# Altium schematic sheet MSP432P401R_Mini_System.SchDoc
size A4
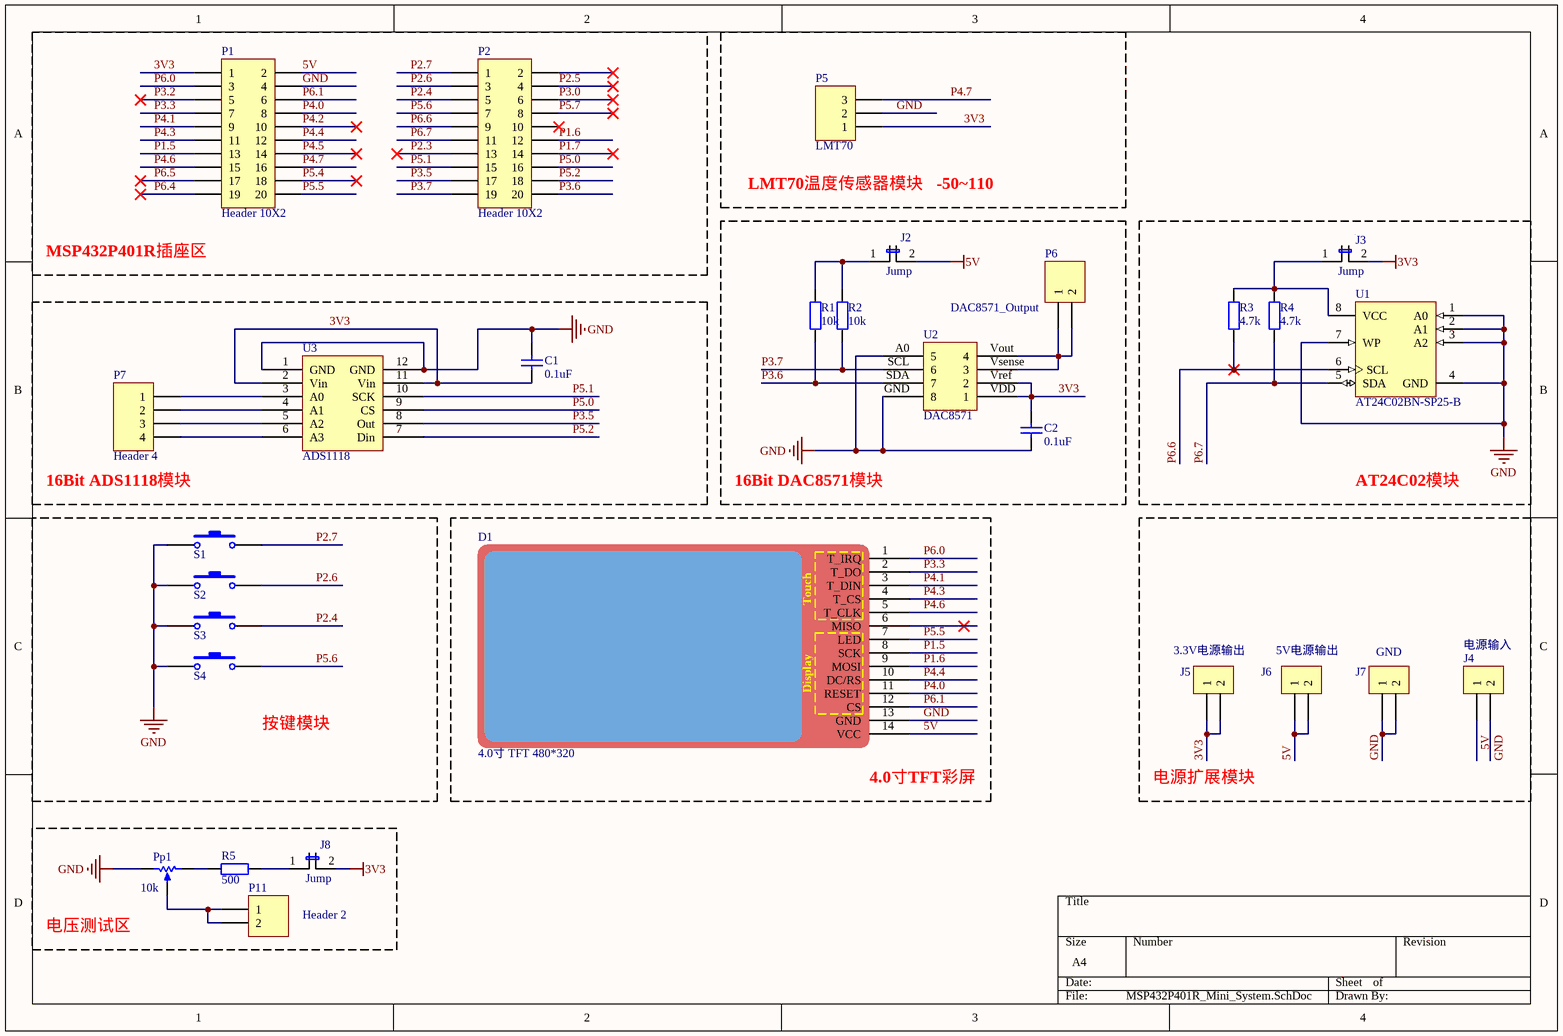
[diagram p0: MSP432P401R_Mini_System.SchDoc]

## Parts
C1  0.1uF  [0805_C]
C2  0.1uF  [0805_C]
D1  4.0寸 TFT 480*320  [4.0 TFT]
J2  Jump  [Jump]
J3  Jump  [Jump]
J4  电源输入  [XH2.54-2P]
J5  3.3V电源输出  [WJ500V-5.08-2]
J6  5V电源输出  [WJ500V-5.08-2]
J7  GND  [WJ500V-5.08-2]
J8  Jump  [jump]
P1  Header 10X2  [HDR2X10]
P2  Header 10X2  [HDR2X10]
P5  LMT70  [HDR-1X3_M]
P6  DAC8571_Output  [HDR-1X2_H]
P7  Header 4  [HDR1X4]
P11  Header 2  [HDR1X2]
Pp1  10k  [RM065]
R1  10k  [0805_R]
R2  10k  [0805_R]
R3  4.7k  [0805_R]
R4  4.7k  [0805_R]
R5  500  [0805_R]
S1  S1  [TSW SMD-3*6*4.3]
S2  S2  [TSW SMD-3*6*4.3]
S3  S3  [TSW SMD-3*6*4.3]
S4  S4  [TSW SMD-3*6*4.3]
U1  AT24C02BN-SP25-B  [DIP8-300_MH]
U2  DAC8571  [DIP8-300_MH]
U3  ADS1118  [ADS1118]

## Blocks framed on the sheet
MSP432P401R插座区: P1 P2
LMT70温度传感器模块   -50~110: P5
16Bit DAC8571模块: C2 J2 P6 R1 R2 U2
AT24C02模块: J3 R3 R4 U1
16Bit ADS1118模块: C1 P7 U3
按键模块: S1-S4
4.0寸TFT彩屏: D1
电源扩展模块: J4-J7
电压测试区: J8 P11 Pp1 R5

## Nets
3V3: C1.1 C2.2 J3.2 J5.1 J5.2 J8.2 P1.1 P5.1 U2.VDD(1) U2.Vref(2) U3.2(Vin) U3.11(Vin)
5V: D1.14(VCC) J2.2 J4.1 J6.1 J6.2 P1.2
GND: C1.2 C2.1 D1.13(GND) J4.2 J7.1 J7.2 P1.4 P5.2 Pp1.3(BOT) S1.1 S2.1 S3.1 S4.1 U1.1(A0) U1.2(A1) U1.3(A2) U1.4(GND) U1.7(WP) U2.A0(5) U2.GND(8) U3.1(GND) U3.12(GND)
P1.5: D1.8(SCK) P1.13
P1.6: D1.9(MOSI) P2.12
P1.7: P2.14
P2.3: P2.13
P2.4: P2.5 S3.2
P2.5: P2.4
P2.6: P2.3 S2.2
P2.7: P2.1 S1.2
P3.0: P2.6
P3.2: P1.5
P3.3: D1.2(T_DO) P1.7
P3.5: P2.17 U3.8(Out)
P3.6: P2.20 R1.1 U2.SDA(7)
P3.7: P2.19 R2.1 U2.SCL(6)
P4.0: D1.11(RESET) P1.8
P4.1: D1.3(T_DIN) P1.9
P4.2: P1.10
P4.3: D1.4(T_CS) P1.11
P4.4: D1.10(DC/RS) P1.12
P4.5: P1.14
P4.6: D1.5(T_CLK) P1.15
P4.7: P1.16 P5.3
P5.0: P2.16 U3.9(CS)
P5.1: P2.15 U3.10(SCK)
P5.2: P2.18 U3.7(Din)
P5.4: P1.18
P5.5: D1.7(LED) P1.20
P5.6: P2.7 S4.2
P5.7: P2.8
P6.0: D1.1(T_IRQ) P1.3
P6.1: D1.12(CS) P1.6
P6.4: P1.19
P6.5: P1.17
P6.6: P2.9 R3.1 U1.6(SCL)
P6.7: P2.11 R4.1 U1.5(SDA)
NetJ2_1: J2.1 R1.2 R2.2
NetJ3_1: J3.1 R3.2 R4.2 U1.8(VCC)
NetJ8_1: J8.1 R5.1
NetP6_1: P6.1 P6.2 U2.Vout(4) U2.Vsense(3)
NetP7_1: P7.1 U3.3(A0)
NetP7_2: P7.2 U3.4(A1)
NetP7_3: P7.3 U3.5(A2)
NetP7_4: P7.4 U3.6(A3)
NetP11_1: P11.1 P11.2 Pp1.2(TAP)
NetPp1_1: Pp1.1(TOP) R5.2

Not connected (* = marked no-connect by the designer): D1 6(MISO)*; P2 2* 10*

## Notes on the sheet
- (in symbol 4.0寸 TFT 480*320) Touch; Display

## Library data of the parts
C1 C2 = Cap Nicklon: CBB聚乙烯薄膜电容; Value: 100nF; Voltage: 63V; Published: 8-Jun-2000; Revision: July-2002: Re-released for DXP Platform.; Publisher: Altium Limited; 实物样品照片: https://item.taobao.com/item.htm?spm=a230r.1.14.32.21fd24b7VWml4d&id=37914290992&ns=1&abbucket=13#detail
J4 = CON2: 连接器
J5-J7 = KF128-5.08MM-2P: 接线端子; ComponentLink1URL: https://detail.tmall.com/item.htm?spm=a1z10.5-b.w4011-14865958799.193.B0p41N&id=45905508377&rn=e90e7252b5175cd006380c5c01151190&abbucket=9; price: 0.5; Supplier: Farpu; SuppliersPartNumber: *; Manufacturer: *; ComponentLink1Description: 供应商链接
P1 P2 = Header 10X2: Header, 10-Pin, Dual row; LatestRevisionDate: 17-Jul-2002; LatestRevisionNote: Re-released for DXP Platform.; Publisher: Altium Limited
P5 = Header 3: Header, 3-Pin; LatestRevisionDate: 17-Jul-2002; LatestRevisionNote: Re-released for DXP Platform.; Publisher: Altium Limited
P6 P11 = Header 2: Header, 2-Pin; LatestRevisionDate: 17-Jul-2002; LatestRevisionNote: Re-released for DXP Platform.; Publisher: Altium Limited
P7 = Header 4: Header, 4-Pin; LatestRevisionDate: 17-Jul-2002; LatestRevisionNote: Re-released for DXP Platform.; Publisher: Altium Limited
Pp1 = RP_3296: 3296电位器; 购买链接: https://item.taobao.com/item.htm?spm=a230r.1.14.90.21641e34zQj3ul&id=19303265869&ns=1&abbucket=13#detail
R1-R5 = Res2: Resistor; Value: 1K; Published: 8-Jun-2000; LatestRevisionDate: 17-Jul-2002; LatestRevisionNote: Re-released for DXP Platform.; PackageReference: AXIAL-0.4; Publisher: Altium Limited; PackageDescription: Axial Device, Thru-Hole; 2 Leads; 0.4 in Pin Spacing
S1-S4 = SW-PB: Tactile Switch触觉开关; Published: 24-Mar-1999; LatestRevisionDate: 17-Jul-2002; LatestRevisionNote: Re-released for DXP Platform.; PackageReference: SPST-2; Publisher: Altium Limited
U1 = AT24C02BN-SP25-B: 2Kbit (256 x 8), 2-wire Bus Automotive Serial EEPROM with full memory Write Protect, 2.5V, 8-Pin SOIC, Bulk; Published: 20-Sep-2010; DatasheetVersion: 8517C,  Jan-2009; PackageVersion: revC, Mar-2005; PackageReference: 8S1; Publisher: Altium Limited; PackageDescription: 8-Lead (0.150" Wide Body), Plastic Gull Wing Small Outline (JEDEC SOIC); Code_JEDEC: MS-012-AA; Code_IPC: SOIC127P600-8; ComponentLink1Description: Manufacturer Link; ComponentLink1URL: http://www.atmel.com/products/serial/default.asp; ComponentLink2Description: Datasheet; ComponentLink2URL: http://www.atmel.com/dyn/resources/prod_documents/doc8517.pdf; ComponentLink3Description: Atmel.com Home; ComponentLink3URL: http://www.atmel.com
U2 = DAC8571: 16位DAC芯片，将数字量转化为模拟电压输出; pin to pad: A0>5 GND>8 SCL>6 SDA>7 VDD>1 Vout>4 Vref>2 Vsense>3
U3 = ADS1118: 16位ADC芯片，将模拟电压信号转化为数字信号供单片机处理